# Altium project 200103 Brake Module R1.PrjPcb
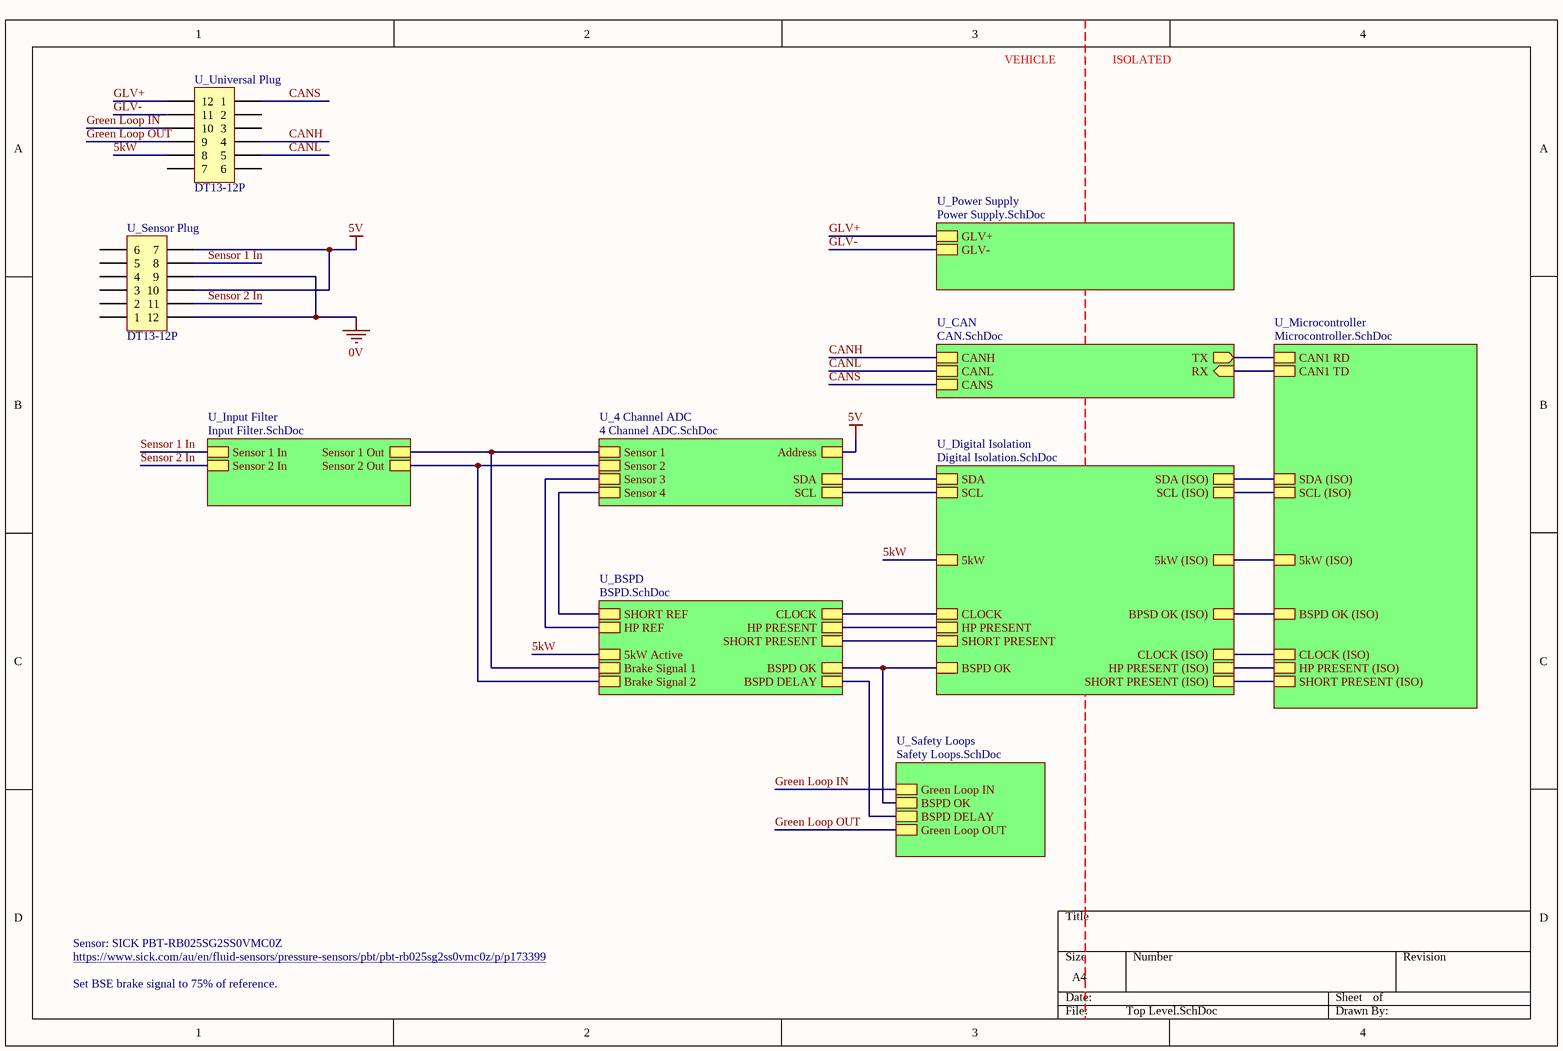
[diagram p0: Top Level.SchDoc]
2 sheets, 4 parts. Net scope: hierarchical (ports join the sheet entries above them; power ports are global).
Board file: Brake Module PCB.PcbDoc
Sheets:
  Top Level.SchDoc
    U_4 Channel ADC = 4 Channel ADC.SchDoc

## Sheet Top Level.SchDoc
size A4

### Parts
U_Sensor_Plug  DT13-12P  [DT13-12P]
U_Universal_Plug  DT13-12P  [DT13-12P]

### Sub-sheets
U_4 Channel ADC = 4 Channel ADC.SchDoc: Address, SCL, SDA, Sensor 1, Sensor 2, Sensor 3, Sensor 4
U_BSPD = BSPD.SchDoc (file not in this document): BSPD OK, HP PRESENT, SHORT PRESENT, CLOCK, HP REF, SHORT REF, 5kW Active, Brake Signal 1, Brake Signal 2, BSPD DELAY
U_CAN = CAN.SchDoc (file not in this document): CANS, RX (in), CANL, CANH, TX (out)
U_Digital Isolation = Digital Isolation.SchDoc (file not in this document): SDA (ISO), SCL (ISO), SDA, SCL, CLOCK (ISO), HP PRESENT (ISO), SHORT PRESENT (ISO), BPSD OK (ISO), 5kW, 5kW (ISO), BSPD OK, HP PRESENT, SHORT PRESENT, CLOCK
U_Input Filter = Input Filter.SchDoc (file not in this document): Sensor 1 In, Sensor 1 Out, Sensor 2 In, Sensor 2 Out
U_Microcontroller = Microcontroller.SchDoc (file not in this document): BSPD OK (ISO), 5kW (ISO), CLOCK (ISO), HP PRESENT (ISO), SHORT PRESENT (ISO), SDA (ISO), SCL (ISO), CAN1 RD, CAN1 TD
U_Power Supply = Power Supply.SchDoc (file not in this document): GLV+, GLV-
U_Safety Loops = Safety Loops.SchDoc (file not in this document): Green Loop OUT, Green Loop IN, BSPD OK, BSPD DELAY

### Nets
0V: U_Sensor_Plug.9 U_Sensor_Plug.12
5V: U_Sensor_Plug.7 U_Sensor_Plug.10 ; sheet U_4 Channel ADC/Address
5kW: U_Universal_Plug.8 ; sheet U_BSPD/5kW Active, sheet U_Digital Isolation/5kW
CANH: U_Universal_Plug.4 ; sheet U_CAN/CANH
CANL: U_Universal_Plug.5 ; sheet U_CAN/CANL
CANS: U_Universal_Plug.1 ; sheet U_CAN/CANS
GLV+: U_Universal_Plug.12 ; sheet U_Power Supply/GLV+
GLV-: U_Universal_Plug.11 ; sheet U_Power Supply/GLV-
Green Loop IN: U_Universal_Plug.10 ; sheet U_Safety Loops/Green Loop IN
Green Loop OUT: U_Universal_Plug.9 ; sheet U_Safety Loops/Green Loop OUT
Sensor 1 In: U_Sensor_Plug.8 ; sheet U_Input Filter/Sensor 1 In
Sensor 2 In: U_Sensor_Plug.11 ; sheet U_Input Filter/Sensor 2 In
NetU4_4: sheet U_BSPD/Brake Signal 1, sheet U_4 Channel ADC/Sensor 1, sheet U_Input Filter/Sensor 1 Out
NetU4_5: sheet U_BSPD/Brake Signal 2, sheet U_4 Channel ADC/Sensor 2, sheet U_Input Filter/Sensor 2 Out
NetU4_6: sheet U_BSPD/HP REF, sheet U_4 Channel ADC/Sensor 3
NetU4_7: sheet U_BSPD/SHORT REF, sheet U_4 Channel ADC/Sensor 4
NetU4_9: sheet U_4 Channel ADC/SDA, sheet U_Digital Isolation/SDA
NetU4_10: sheet U_4 Channel ADC/SCL, sheet U_Digital Isolation/SCL
(unnamed): sheet U_BSPD/BSPD OK, sheet U_Digital Isolation/BSPD OK, sheet U_Safety Loops/BSPD OK
(unnamed): sheet U_BSPD/HP PRESENT, sheet U_Digital Isolation/HP PRESENT
(unnamed): sheet U_BSPD/SHORT PRESENT, sheet U_Digital Isolation/SHORT PRESENT
(unnamed): sheet U_BSPD/CLOCK, sheet U_Digital Isolation/CLOCK
(unnamed): sheet U_BSPD/BSPD DELAY, sheet U_Safety Loops/BSPD DELAY
(unnamed): sheet U_Digital Isolation/SDA (ISO), sheet U_Microcontroller/SDA (ISO)
(unnamed): sheet U_Digital Isolation/SCL (ISO), sheet U_Microcontroller/SCL (ISO)
(unnamed): sheet U_Digital Isolation/CLOCK (ISO), sheet U_Microcontroller/CLOCK (ISO)
(unnamed): sheet U_Digital Isolation/HP PRESENT (ISO), sheet U_Microcontroller/HP PRESENT (ISO)
(unnamed): sheet U_Digital Isolation/SHORT PRESENT (ISO), sheet U_Microcontroller/SHORT PRESENT (ISO)
(unnamed): sheet U_Digital Isolation/BPSD OK (ISO), sheet U_Microcontroller/BSPD OK (ISO)
(unnamed): sheet U_Digital Isolation/5kW (ISO), sheet U_Microcontroller/5kW (ISO)
(unnamed): sheet U_Microcontroller/CAN1 RD, sheet U_CAN/TX
(unnamed): sheet U_Microcontroller/CAN1 TD, sheet U_CAN/RX

Not connected (* = marked no-connect by the designer): U_Sensor_Plug 1 2 3 4 5 6; U_Universal_Plug 2 3 6 7

### Notes on the sheet
- VEHICLE
- ISOLATED
- Sensor: SICK PBT-RB025SG2SS0VMC0Z
- https://www.sick.com/au/en/fluid-sensors/pressure-sensors/pbt/pbt-rb025sg2ss0vmc0z/p/p173399
- Set BSE brake signal to 75% of reference.

### Library data of the parts
U_Sensor_Plug U_Universal_Plug = DT13-12P[[/\]]DT13-12P: Positions: 12; Pitch: 4.44mm; Row Spacing: 6.35mm; Angle: 90; Flange: Yes; Contact: Nickel; Part Number: DT13-12P; Digikey Part Number: 1734-1451-ND; Digikey Link: https://www.digikey.com.au/product-detail/en/te-connectivity-deutsch-connectors/DT13-12PA/1734-1451-ND/7220123

## Sheet 4 Channel ADC.SchDoc
size A4
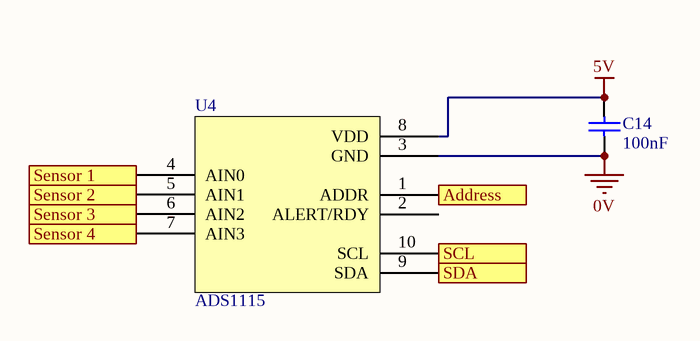
[diagram p1: 4 Channel ADC.SchDoc]

### Parts
C14  100nF  [0805]
U4  ADS1115  [TI 10-VSSOP]

### Ports
Address, SCL, SDA, Sensor 1, Sensor 2, Sensor 3, Sensor 4

### Nets
0V: C14.1 U4.3(GND)
5V: C14.2 U4.1(ADDR) U4.8(VDD) ; port Address
NetU4_4: U4.4(AIN0) ; port Sensor 1
NetU4_5: U4.5(AIN1) ; port Sensor 2
NetU4_6: U4.6(AIN2) ; port Sensor 3
NetU4_7: U4.7(AIN3) ; port Sensor 4
NetU4_9: U4.9(SDA) ; port SDA
NetU4_10: U4.10(SCL) ; port SCL

Not connected (* = marked no-connect by the designer): U4 2(ALERT/RDY)

### Library data of the parts
C14 = GCM21BR71E104KA37L: Manufacturer: muRata; Tolerance: 10%; Material: X7R; Rated Voltage: 25V; Part Number: GCM21BR71E104KA37L; Value: 100nF
U4 = ADS1115: 16 Bit Analog to Digital Converter 2, 4 Input 1 Sigma-Delta 10-VSSOP; Manufacturer: Texas Instruments; Part Number: ADS1115; Digikey Part Number: 296-38849-1-ND; Digikey Link: https://www.digikey.com/product-detail/en/texas-instruments/ADS1115IDGSR/296-38849-1-ND/5142969

## Nets that join several sheets
0V: Top Level (U_Sensor_Plug.9 U_Sensor_Plug.12), 4 Channel ADC (C14.1 U4.3)
5V: Top Level (U_Sensor_Plug.7 U_Sensor_Plug.10), 4 Channel ADC (C14.2 U4.1 U4.8)